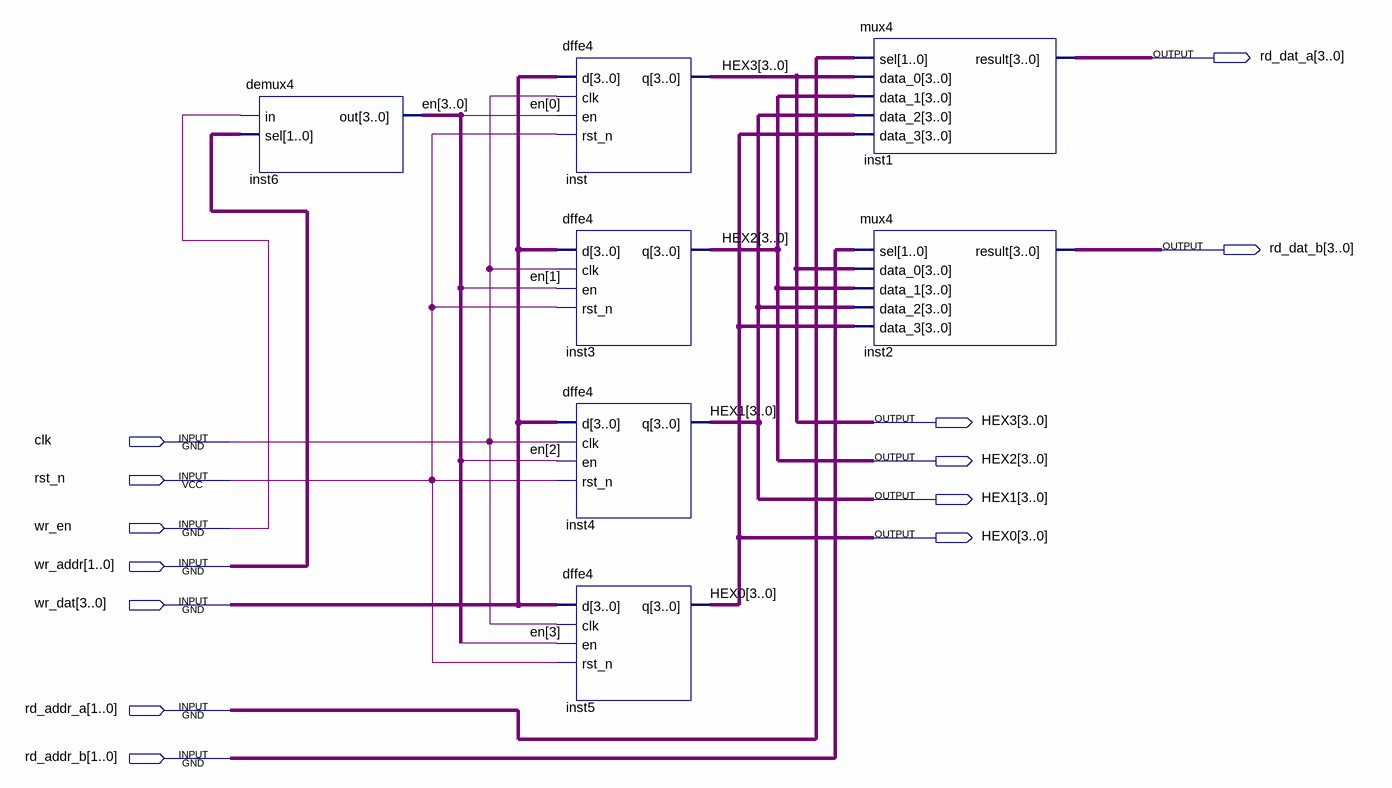
[diagram p0: schematic sheet]
// Quartus schematic reg_file.bdf as structural Verilog: 7 symbols, 13 pins
module reg_file (
  input  clk,
  input  rst_n,
  input  wr_en,
  input  [1:0] wr_addr,
  input  [3:0] wr_dat,
  input  [1:0] rd_addr_a,
  input  [1:0] rd_addr_b,
  output [3:0] rd_dat_a,
  output [3:0] rd_dat_b,
  output [3:0] HEX3,
  output [3:0] HEX2,
  output [3:0] HEX1,
  output [3:0] HEX0
);

  wire [3:0] en;

  demux4 inst6 (.in(wr_en), .sel(wr_addr), .out(en));
  dffe4 inst (.d(wr_dat), .clk(clk), .en(en[0]), .rst_n(rst_n), .q(HEX3));
  dffe4 inst3 (.d(wr_dat), .clk(clk), .en(en[1]), .rst_n(rst_n), .q(HEX2));
  dffe4 inst4 (.d(wr_dat), .clk(clk), .en(en[2]), .rst_n(rst_n), .q(HEX1));
  dffe4 inst5 (.d(wr_dat), .clk(clk), .en(en[3]), .rst_n(rst_n), .q(HEX0));
  mux4 inst1 (.sel(rd_addr_a), .data_0(HEX3), .data_1(HEX2), .data_2(HEX1), .data_3(HEX0), .result(rd_dat_a));
  mux4 inst2 (.sel(rd_addr_b), .data_0(HEX3), .data_1(HEX2), .data_2(HEX1), .data_3(HEX0), .result(rd_dat_b));
endmodule
